# Altium schematic sheet Title Sheet.SchDoc
size A
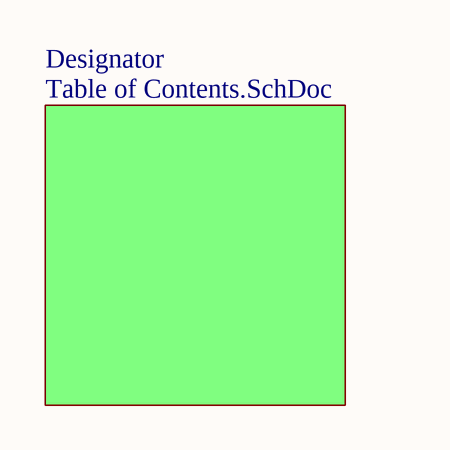
[diagram p0: Title Sheet.SchDoc]

## Sub-sheets
Designator = Table of Contents.SchDoc: no entries